# EAGLE design untitled (EAGLE 9.6.0)
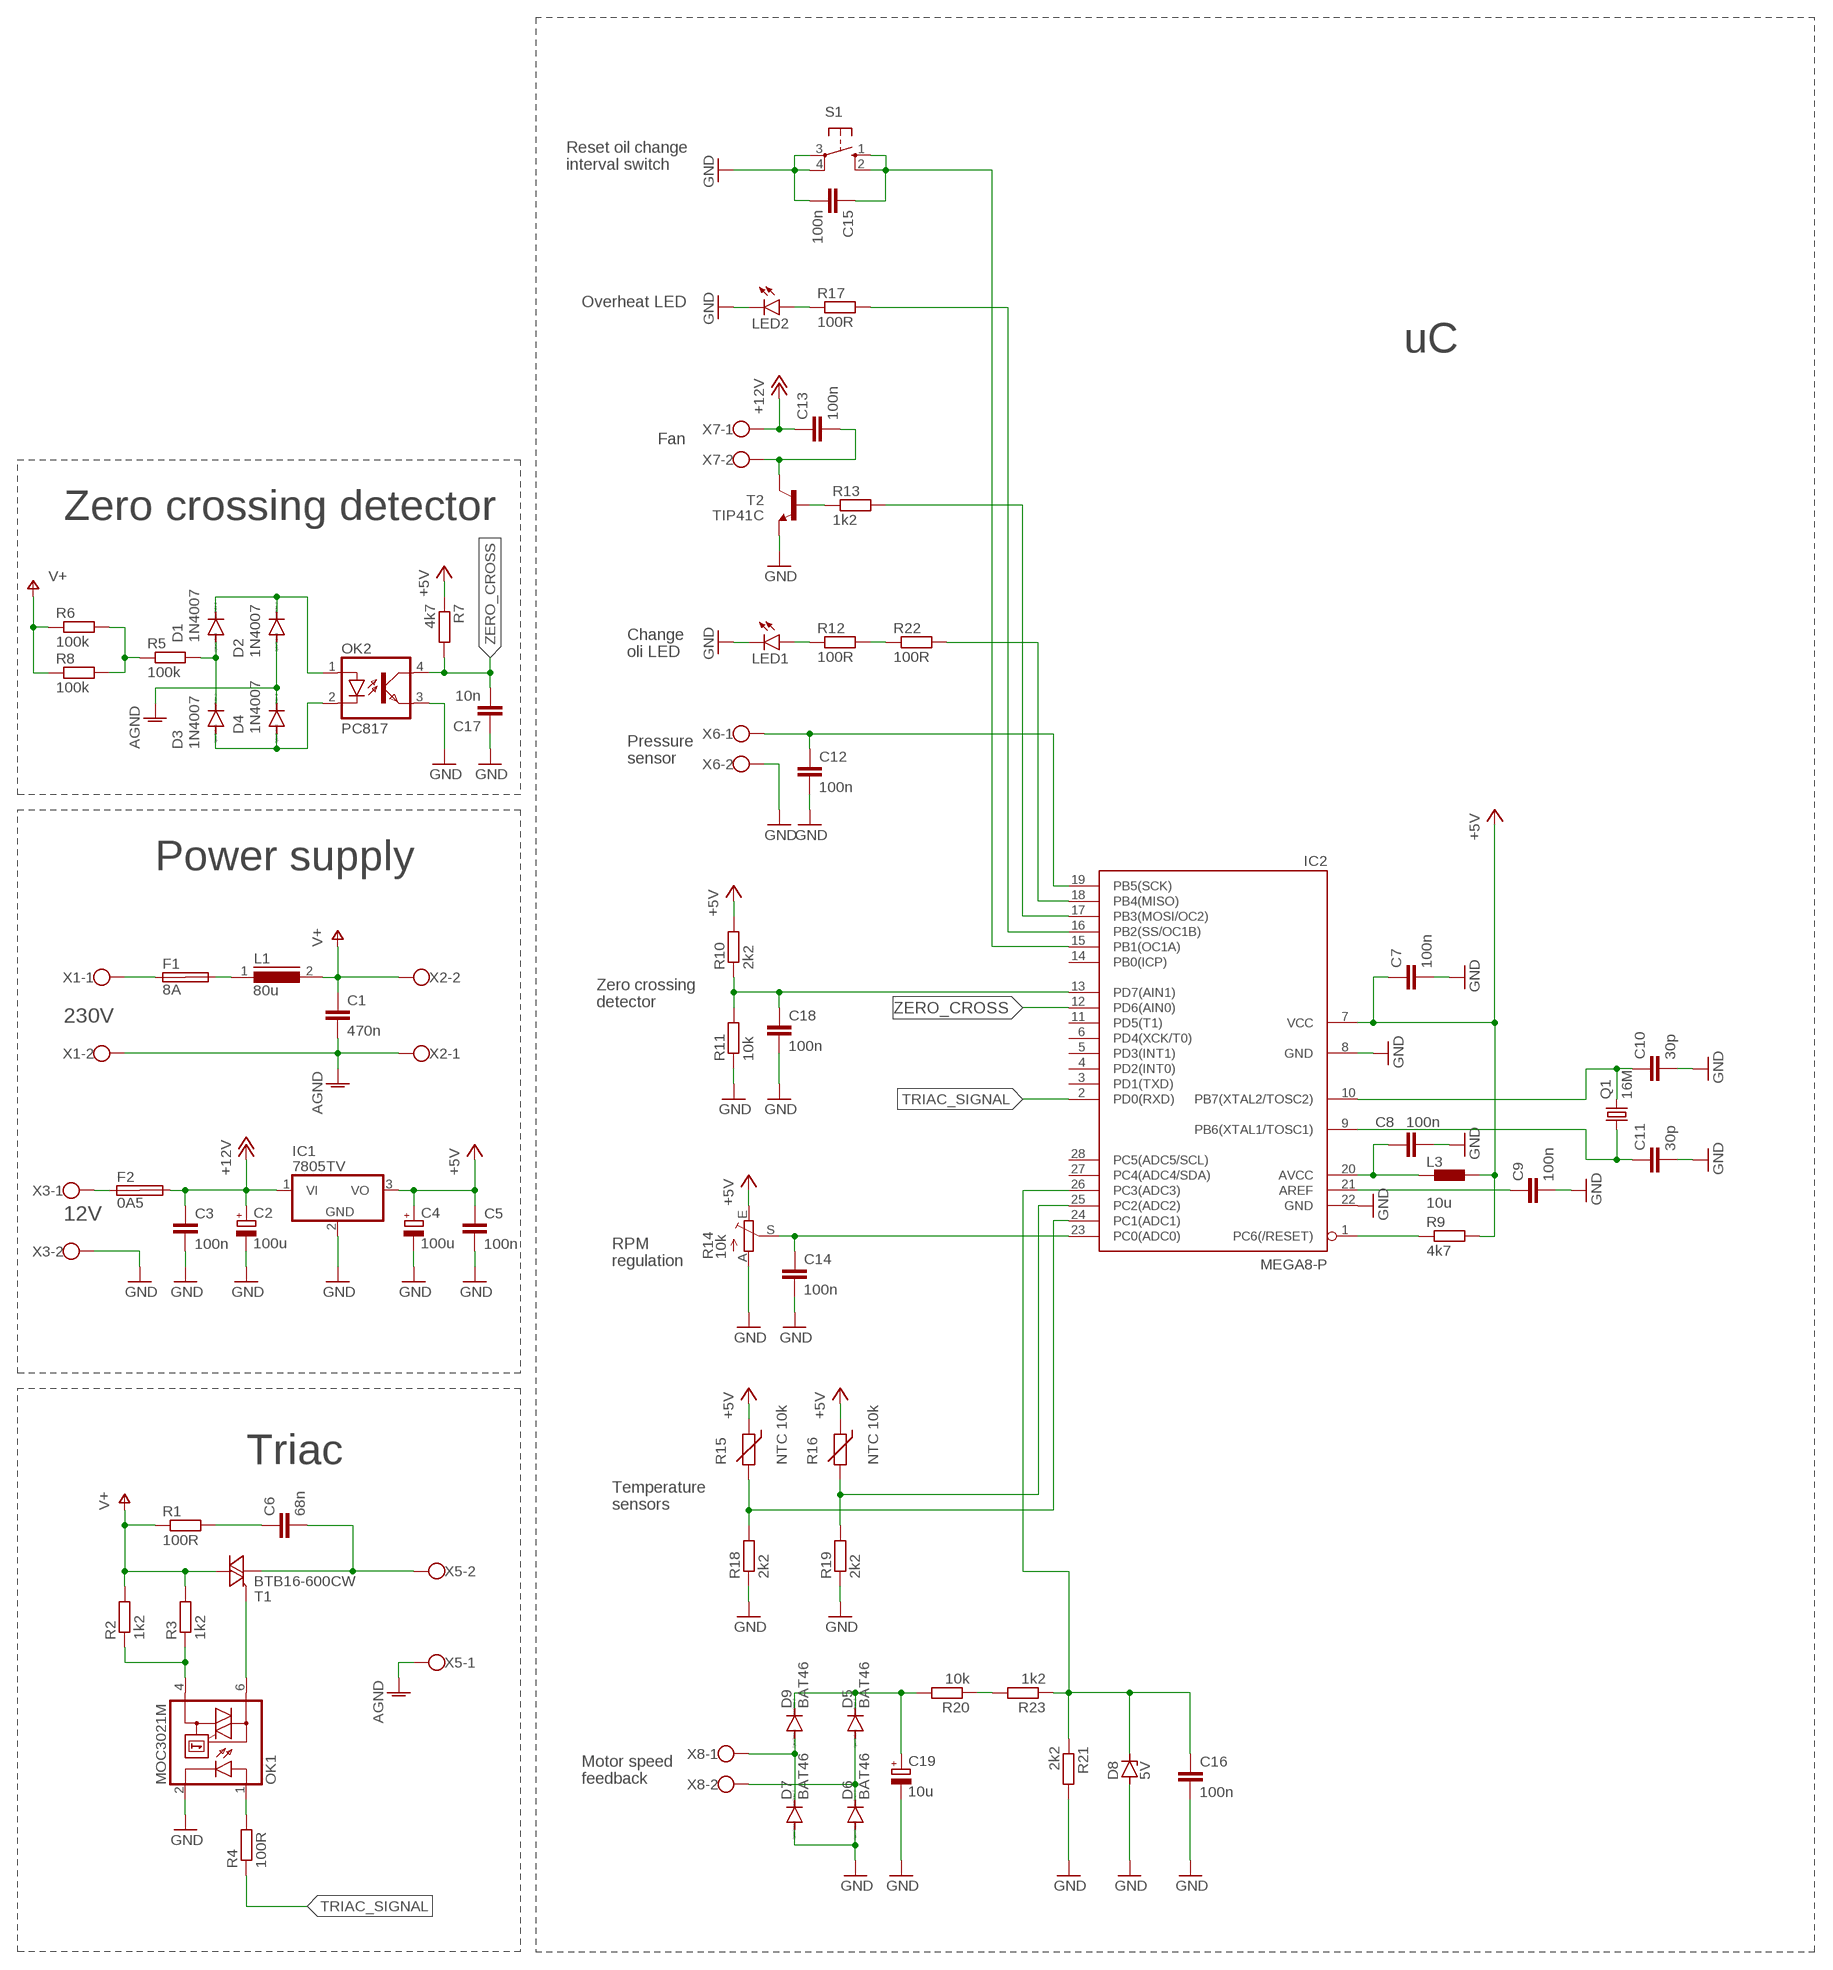
[diagram p0: schematic, sheet 1]

## Parts
C1  470n  C22/7  [C22.5B7]
C2  100u  CPOL-EUE3.5-8  [E3,5-8]
C3  100n  C5/3  [C5B3]
C4  100u  CPOL-EUE3.5-8  [E3,5-8]
C5  100n  C5/3  [C5B3]
C6  68n  C-EU150-084X183  [C150-084X183]
C7  100n  C5/3  [C5B3]
C8  100n  C5/3  [C5B3]
C9  100n  C5/3  [C5B3]
C10  30p  C5/3  [C5B3]
C11  30p  C5/3  [C5B3]
C12  100n  C5/3  [C5B3]
C13  100n  C5/3  [C5B3]
C14  100n  C5/3  [C5B3]
C15  100n  C5/3  [C5B3]
C16  100n  C5/3  [C5B3]
C17  10n  C5/3  [C5B3]
C18  100n  C5/3  [C5B3]
C19  10u  CPOL-EUE2.5-6  [E2,5-6]
D1  1N4007  1N4933  [DO41-10]
D2  1N4007  1N4933  [DO41-10]
D3  1N4007  1N4933  [DO41-10]
D4  1N4007  1N4933  [DO41-10]
D5  BAT46  BAS15  [DO34-7]
D6  BAT46  BAS15  [DO34-7]
D7  BAT46  BAS15  [DO34-7]
D8  5V  ZENER-DIODEDO34-7  [DO34Z7]
D9  BAT46  BAS15  [DO34-7]
F1  8A  SHK20L  [SHK20L]
F2  0A5  SHK20L  [SHK20L]
IC1  7805TV  [TO220V]
IC2  MEGA8-P  [DIL28-3]
L1  80u  SFT1030  [SFT1030]
L3  10u  BL01RN1A  [BL01RN1A]
LED1  LED5MM  [LED5MM]
LED2  LED5MM  [LED5MM]
OK1  MOC3021M  [DIL06]
OK2  PC817  [DIL04]
Q1  16M  CRYSTALHC49S  [HC49/S]
R1  100R  R-EU_0204/7  [0204/7]
R2  1k2  R-EU_0204/7  [0204/7]
R3  1k2  R-EU_0204/7  [0204/7]
R4  100R  R-EU_0204/7  [0204/7]
R5  100k  R-EU_0204/7  [0204/7]
R6  100k  R-EU_0204/7  [0204/7]
R7  4k7  R-EU_0204/7  [0204/7]
R8  100k  R-EU_0204/7  [0204/7]
R9  4k7  R-EU_0204/7  [0204/7]
R10  2k2  R-EU_0204/7  [0204/7]
R11  10k  R-EU_0204/7  [0204/7]
R12  100R  R-EU_0204/7  [0204/7]
R13  1k2  R-EU_0204/7  [0204/7]
R14  10k  TRIM_EU-RJ9W  [RJ9W]
R15  NTC 10k  THERMISTOR-7,5  [R-7,5]
R16  NTC 10k  THERMISTOR-7,5  [R-7,5]
R17  100R  R-EU_0204/7  [0204/7]
R18  2k2  R-EU_0204/7  [0204/7]
R19  2k2  R-EU_0204/7  [0204/7]
R20  10k  R-EU_0204/7  [0204/7]
R21  2k2  R-EU_0204/7  [0204/7]
R22  100R  R-EU_0204/7  [0204/7]
R23  1k2  R-EU_0204/7  [0204/7]
S1  10-XX  [B3F-10XX]
T1  BTB16-600CW  BT138-V  [TO220BV]
T2  TIP41C  -NPN-TO220V  [TO220V]
X1  W237-102  [W237-102]
X2  W237-102  [W237-102]
X3  W237-102  [W237-102]
X5  W237-102  [W237-102]
X6  W237-102  [W237-102]
X7  W237-102  [W237-102]
X8  W237-102  [W237-102]

## Nets
+5V: C4.+ C5.1 C7.1 IC1.3(VO) IC2.7(VCC) L3.2 R7.1 R9.2 R10.2 R14.E R15.1 R16.1
+12V: C2.+ C3.1 C13.1 F2.2A IC1.1(VI) X7.1
AGND: C1.2 D2.A D4.C X1.2 X2.1 X5.1
GND: C2.- C3.2 C4.- C5.2 C7.2 C8.2 C9.2 C10.2 C11.2 C12.2 C14.2 C15.2 C16.2 C17.1 C18.2 C19.- D6.A D7.A D8.A IC1.2(GND) IC2.8(GND) IC2.22(GND) LED1.K(C) LED2.K(C) OK1.2(C) OK2.3(EMIT) R11.1 R14.A R18.1 R19.1 R21.2 S1.3(P) S1.4(P1) T2.3(E) X3.2 X6.2
N$1: F1.1A X1.1
N$2: F1.2A L1.1
N$3: OK1.6(A2) T1.G
N$4: C6.2 T1.T1(A1) X5.2
N$5: C6.1 R1.2
N$6: OK1.4(A1) R2.1 R3.1
N$7: F2.1A X3.1
N$8: OK1.1(A) R4.2
N$9: D1.C D2.C OK2.1(A)
N$10: D3.A D4.A OK2.2(C)
N$11: R5.1 R6.2 R8.2
N$12: D7.C D9.A X8.1
N$13: C18.1 IC2.13(PD7(AIN1)) R10.1 R11.2
N$14: C8.1 IC2.20(AVCC) L3.1
N$15: C9.1 IC2.21(AREF)
N$16: IC2.1(PC6(/RESET)) R9.1
N$17: C10.1 IC2.10(PB7(XTAL2/TOSC2)) Q1.2
N$18: C11.1 IC2.9(PB6(XTAL1/TOSC1)) Q1.1
N$19: C12.1 IC2.19(PB5(SCK)) X6.1
N$20: LED1.A R12.1
N$21: IC2.18(PB4(MISO)) R22.2
N$22: C13.2 T2.2(C) X7.2
N$23: R13.1 T2.1(B)
N$24: IC2.17(PB3(MOSI/OC2)) R13.2
N$25: C14.1 IC2.23(PC0(ADC0)) R14.S
N$26: IC2.24(PC1(ADC1)) R15.2 R18.2
N$27: IC2.25(PC2(ADC2)) R16.2 R19.2
N$28: LED2.A R17.1
N$29: IC2.16(PB2(SS/OC1B)) R17.2
N$30: C19.+ D5.C D9.C R20.2
N$31: C15.1 IC2.15(PB1(OC1A)) S1.1(S) S1.2(S1)
N$32: D1.A D3.C R5.2
N$33: D5.A D6.C X8.2
N$34: C16.1 D8.C IC2.26(PC3(ADC3)) R21.1 R23.1
N$35: R12.2 R22.1
N$36: R20.1 R23.2
TRIAC_SIGNAL: IC2.2(PD0(RXD)) R4.1
V+: C1.1 L1.2 R1.1 R2.2 R3.2 R6.1 R8.1 T1.T2(A2) X2.2
ZERO_CROSS: C17.2 IC2.12(PD6(AIN0)) OK2.4(COL) R7.2
Unconnected: F1.1B F1.2B F2.1B F2.2B IC2.3(PD1(TXD)) IC2.4(PD2(INT0)) IC2.5(PD3(INT1)) IC2.6(PD4(XCK/T0)) IC2.11(PD5(T1)) IC2.14(PB0(ICP)) IC2.27(PC4(ADC4/SDA)) IC2.28(PC5(ADC5/SCL))

## Notes on the sheet
- Reset oil change
  interval switch
- Overheat LED
- uC
- Fan
- Zero crossing detector
- Change
  oli LED
- Pressure
  sensor
- Power supply
- Zero crossing
  detector
- 230V
- 12V
- RPM
  regulation
- Triac
- Temperature
  sensors
- Motor speed
  feedback

## Library data of the parts
C1 C3 C5 C7-C18 = capacitor-wima:C: CAPACITOR naming: grid - package width
C2 C4 C19 = rcl:CPOL-EU: POLARIZED CAPACITOR, European symbol; SPICEPREFIX: C
C6 = rcl:C-EU: CAPACITOR, European symbol; SPICEPREFIX: C
D1-D4 = diode:1N4933: DIODE fast recovery rectifier, 1A
D5-D7 D9 = diode:BAS15: DIODE high speed
D8 = diode:ZENER-DIODE: Z-Diode
F1 F2 = fuse:SHK20L: FUSE HOLDER 5 x 20 mm, SH contact, SHH1 Schukat, E1073 Buerklin; OC_FARNELL: unknown; OC_NEWARK: unknown
IC1 = linear:78*: Positive VOLTAGE REGULATOR Source: http://cache.national.com/ds/LM/LM78L05.pdf http://www.fairchildsemi.com/ds/LM/LM7805.pdf
IC2 = atmel:MEGA8-P: MICROCONTROLLER 8 Kbytes FLASH, 1 kbytes SRAM, 512 bytes EEPROM, USART, 4-channel 10 bit ADC, 2-channel 8 bit ADC Pin compatible with Atmega48, ATMega88, ATMega168 Source: avr.lbr; OC_FARNELL: unknown; OC_NEWARK: unknown
L1 = inductors:SFT1030: INDUCTOR; SPICEPREFIX: L
L3 = inductors:BL0: Noise Suppression Products/EMI Suppression Filters, Lead EMIFIL(R) Inductor Type Source: http://www.murata.com .. BL01RN1_DS.pdf
LED1 LED2 = led:LED: LED OSRAM: - CHIPLED LG R971, LG N971, LY N971, LG Q971, LY Q971, LO R971, LY R971 LH N974, LH R974 LS Q976, LO Q976, LY Q976 LO Q996 - Hyper CHIPLED LW Q18S LB Q993, LB Q99A, LB R99A - SideLED LS A670, LO A670, LY A670, LG A670, LP A670 LB A673, LV A673, LT A673, LW A673 LH A674 LY A675 LS A676, LA A676, LO A676, LY A676, LW A676 LS A679, LY A679, LG A679 - Hyper Micro SIDELED® LS Y876, LA Y876, LO Y876, LY Y876 LT Y87S - SmartLED LW L88C, LW L88S LB L89C, LB L89S, LG L890 LS L89K, LO L89K, LY L89K LS L896, LA L896, LO L896, LY L896 - TOPLED LS T670, LO T670, LY T670, LG T670, LP T670 LSG T670, LSP T670, LSY T670, LOP T670, LYG T670 LG T671, LOG T671, LSG T671 LB T673, LV T673, LT T673, LW T673 LH T674 LS T676, LA T676, LO T676, LY T676, LB T676, LH T676, LSB T676, LW T676 LB T67C, LV T67C, LT T67C, LS T67K, LO T67K, LY T67K, LW E67C LS E67B, LA E67B, LO E67B, LY E67B, LB E67C, LV E67C, LT E67C LW T67C LS T679, LY T679, LG T679 LS T770, LO T770, LY T770, LG T770, LP T770 LB T773, LV T773, LT T773, LW T773 LH T774 LS E675, LA E675, LY E675, LS T675 LS T776, LA T776, LO T776, LY T776, LB T776 LHGB T686 LT T68C, LB T68C - Hyper Mini TOPLED® LB M676 - Mini TOPLED Santana® LG M470 LS M47K, LO M47K, LY M47K Source: http://www.osram.convergy.de LUXEON: - LUMILED® LXK2-PW12-R00, LXK2-PW12-S00, LXK2-PW14-U00, LXK2-PW14-V00 LXK2-PM12-R00, LXK2-PM12-S00, LXK2-PM14-U00 LXK2-PE12-Q00, LXK2-PE12-R00, LXK2-PE12-S00, LXK2-PE14-T00, LXK2-PE14-U00 LXK2-PB12-K00, LXK2-PB12-L00, LXK2-PB12-M00, LXK2-PB14-N00, LXK2-PB14-P00, LXK2-PB14-Q00 LXK2-PR12-L00, LXK2-PR12-M00, LXK2-PR14-Q00, LXK2-PR14-R00 LXK2-PD12-Q00, LXK2-PD12-R00, LXK2-PD12-S00 LXK2-PH12-R00, LXK2-PH12-S00 LXK2-PL12-P00, LXK2-PL12-Q00, LXK2-PL12-R00 Source: www.luxeon.com KINGBRIGHT: KA-3528ASYC Source: www.kingbright.com
OK1 = optocoupler:MOC30*M: RANDOM-PHASE OPTOISOLATORS TRIAC DRIVER OUTPUT Source: http://www.fairchildsemi.com MOC3020-M.pdf; MF: FAIRCHILD SEMICONDUCTOR; MPN: MOC3021-M; OC_FARNELL: 1021365; OC_NEWARK: 95B7895
OK2 = optocoupler:PC817: SHARP OPTO COUPLER; MPN: PC817X4J000F; OC_FARNELL: 9707727; OC_NEWARK: 97K7059
Q1 = crystal:CRYSTAL: CRYSTAL; OC_FARNELL: 1667008; OC_NEWARK: unknown
R1-R13 R17-R23 = rcl:R-EU_: RESISTOR, European symbol; SPICEPREFIX: R
R14 = pot:TRIM_EU-: POTENTIOMETER
R15 R16 = varistor:THERMISTOR: THERMISTOR
S1 = switch-omron:10-XX: OMRON SWITCH; MPN: B3F-1000; OC_FARNELL: 176432; OC_NEWARK: 36M3542
T1 = triac:BT138: TRIAC Source: http://www.semiconductors.philips.com BT138_SERIES_2.pdf
T2 = transistor:*-NPN-: NPN Transistror BF959 corrected 2008.03.06
X1-X3 X5-X8 = con-wago-500:W237-102: WAGO SCREW CLAMP; MPN: 237-102; OC_FARNELL: unknown; OC_NEWARK: 70K9898

## Board
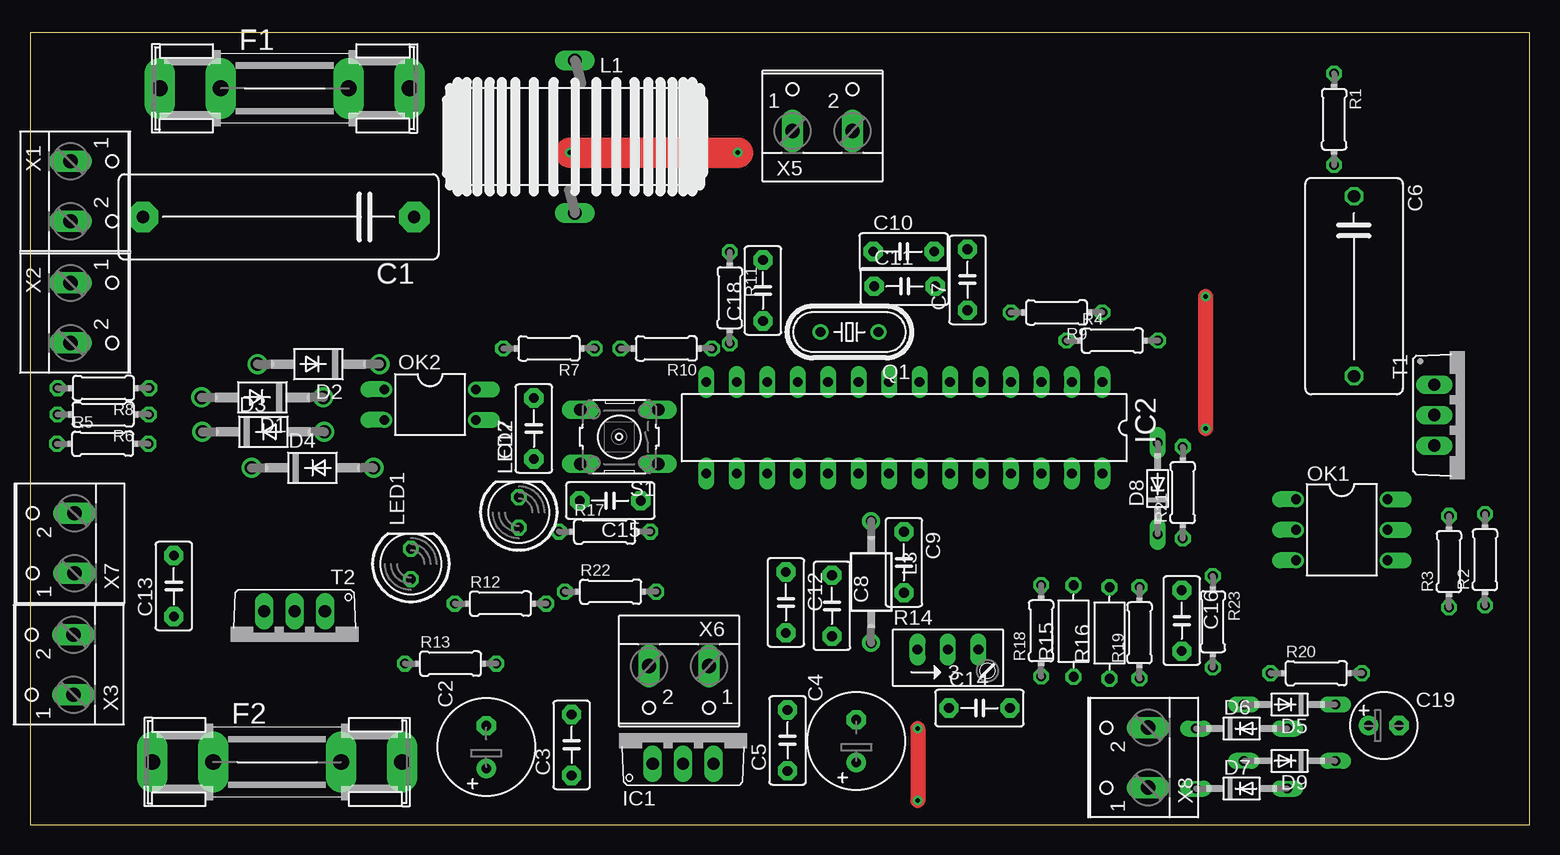
[diagram p1: board, top side]
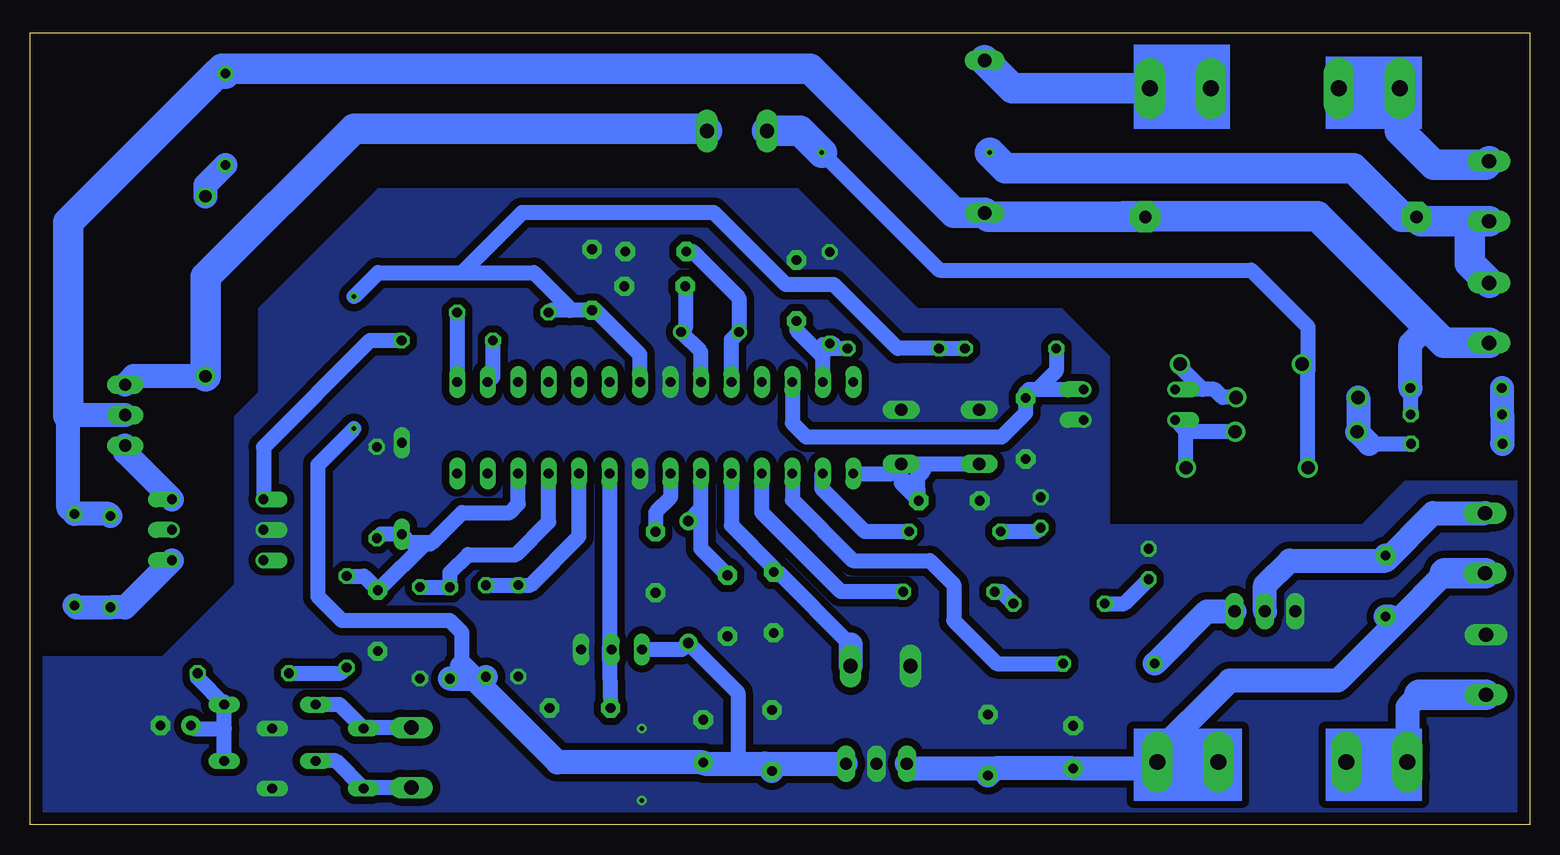
[diagram p2: board, bottom side, seen from below]

Size 125 x 66 mm. Coordinates in mm from the lower left corner, seen from the top.
Outline: 0,0 125,0 125,66 0,66 0,0
Copper layers (1*16): Top 0.035mm / dielectric 1.5mm / Bottom 0.035mm
Design rules "default": minimum track width 6mil, minimum drill 0.35mm, track to track 6mil, track to pad 6mil, pad to pad 6mil, via to via 6mil, smd to smd 6mil, copper to edge 40mil, drill to drill 6mil, minimum pad ring 10mil, minimum via ring 8mil, stop-mask expansion 4mil, vias tented up to drill 0mil, thermal gap 10mil

### Footprints (pad centres in the part's own frame; a part is rotated, then mirrored left to right if it is on the bottom)
C22.5B7 = drill 1.016 pad 2.54 octagon: 1 -11.303,0; 2 11.303,0
E3,5-8 = drill 0.813 pad 1.6: + -1.778,0 | drill 0.813 pad 1.6 octagon: - 1.778,0
C5B3 = drill 0.813 pad 1.6 octagon: 1 -2.54,0; 2 2.54,0
C150-084X183 = drill 1.016 octagon: 1 -7.493,0; 2 7.493,0
E2,5-6 = drill 0.813 pad 1.6: + -1.27,0 | drill 0.813 pad 1.6 octagon: - 1.27,0
DO41-10 = drill 1.118: A 5.08,0; C -5.08,0
DO34-7 = drill 0.813 long: A 3.81,0; C -3.81,0
DO34Z7 = drill 0.813 long: A 3.81,0; C -3.81,0
SHK20L = drill 1.321 pad 2.54 long: 1A -10.414,0; 1B -5.334,0; 2A 10.414,0; 2B 5.334,0
TO220V = drill 1.016 long: 1 -2.54,-2.54; 2 0,-2.54; 3 2.54,-2.54
DIL28-3 = drill 0.813 long: 1 -16.51,-3.81; 2 -13.97,-3.81; 3 -11.43,-3.81; 4 -8.89,-3.81; 5 -6.35,-3.81; 6 -3.81,-3.81; 7 -1.27,-3.81; 8 1.27,-3.81; 9 3.81,-3.81; 10 6.35,-3.81; 11 8.89,-3.81; 12 11.43,-3.81; 13 13.97,-3.81; 14 16.51,-3.81; 15 16.51,3.81; 16 13.97,3.81; 17 11.43,3.81; 18 8.89,3.81; 19 6.35,3.81; 20 3.81,3.81; 21 1.27,3.81; 22 -1.27,3.81; 23 -3.81,3.81; 24 -6.35,3.81; 25 -8.89,3.81; 26 -11.43,3.81; 27 -13.97,3.81; 28 -16.51,3.81
SFT1030 = drill 1.118 long: 1 -6.35,0; 2 6.35,0
BL01RN1A = drill 0.9 pad 1.5: 1 -5.08,0; 2 5.08,0
LED5MM = drill 0.813 octagon: A -1.27,0; K 1.27,0
DIL06 = drill 0.813 offset: 1 -2.54,-3.81; 2 0,-3.81; 3 2.54,-3.81; 4 2.54,3.81; 5 0,3.81; 6 -2.54,3.81
DIL04 = drill 0.813 offset: 1 -1.27,-3.81; 2 1.27,-3.81; 3 1.27,3.81; 4 -1.27,3.81
HC49/S = drill 0.813: 1 -2.413,0; 2 2.413,0
0204/7 = drill 0.813 octagon: 1 -3.81,0; 2 3.81,0
RJ9W = drill 0.813 long: A 2.54,0.635; E -2.54,0.635; S 0,0.635
R-7,5 = drill 0.813 octagon: 1 -3.81,0; 2 3.81,0
B3F-10XX = drill 1.016 long: 1 -3.251,2.261; 2 3.251,2.261; 3 -3.251,-2.261; 4 3.251,-2.261
TO220BV = drill 1.016 long: G 2.54,-2.54; T1 -2.54,-2.54; T2 0,-2.54
W237-102 = drill 1.194 long: 1 -2.5,-1.27; 2 2.5,-1.27

### Placement (x,y rotation side)
C1  20.72,50.63 180 top
C2  38.04,6.45 90 top
C3  45.15,6.63 90 top
C4  68.88,6.95 90 top
C5  63.15,7.01 90 top
C6  110.37,44.86 270 top
C7  78.15,45.39 90 top
C8  66.85,18.23 270 top
C9  72.85,21.85 270 top
C10  72.83,47.75 0 top
C11  72.91,44.85 0 top
C12  63.01,18.51 270 top
C13  11.99,19.87 90 top
C14  79.15,9.71 0 top
C15  48.37,26.99 180 top
C16  96.01,16.99 270 top
C17  42,33 90 top
C18  61.1,44.5 90 top
C19  112.85,8.25 0 top
D1  19.37,35.59 180 top
D2  24.05,38.37 180 top
D3  19.45,32.73 0 top
D4  23.55,29.73 0 top
D5  105,10 180 top
D6  101,8 0 top
D7  101,3 0 top
D8  94,28 90 top
D9  105,5.3 180 top
F1  21.23,61.35 0 top
F2  20.6,5.21 0 top
IC1  54.45,7.61 0 top
IC2  72.88,33.06 180 top
L1  45.43,57.32 270 top
L3  70.12,20.21 270 top
LED1  31.75,21.71 90 top
LED2  40.75,26.01 90 top
OK1  109.35,24.56 270 top
OK2  33.35,34.99 270 top
Q1  68.31,41.04 180 top
R1  108.71,58.77 270 top
R2  121.29,22.07 90 top
R3  118.29,21.91 90 top
R4  90.22,40.33 0 top
R5  6.06,31.73 0 top
R6  6.1,34.17 180 top
R7  43.26,39.67 180 top
R8  6.12,36.37 180 top
R9  85.58,42.67 180 top
R10  53.04,39.67 180 top
R11  58.33,43.9 270 top
R12  39.22,18.41 0 top
R13  35.06,13.41 0 top
R14  76.52,13.96 0 top
R15  86.99,16.12 90 top
R16  89.99,15.96 90 top
R17  47.9,24.41 0 top
R18  84.29,16.14 90 top
R19  92.49,15.98 90 top
R20  107.22,12.61 0 top
R21  96.09,27.66 90 top
R22  48.4,19.4 0 top
R23  98.6,16.9 270 top
S1  49.12,32.31 180 top
T1  119.61,34.12 270 top
T2  22.05,15.23 180 top
X1  4.64,52.77 270 top
X2  4.64,42.63 270 top
X3  2.36,13.31 90 top
X5  66.06,59.07 0 top
X6  54.1,11.93 180 top
X7  2.43,23.44 90 top
X8  91.93,5.58 90 top

### Tracks (layer width: path | path; a pad name or v marks a point on that pad's centre or on a via)
+5V  (via drill 0.35)
  Top 1.27: v98,33 v98,44
  Bottom 1.27: IC2.7 74.15,39.15 78,43 C7.1 80,42.85 | 80,42.85 81.59,42.85 R9.2 | 66,5.07 66,11 L3.2 70.66,14.6 R14.E | 88,12.15 87.15,12.15 | R7.1 R10.2 52.67,39.67 58,45 62,45 68,51 84,51 89,46 | 89,13.15 89,16 90,17 99,17 101,19 101,30 v98,33 | v98,44 96,46 89,46 | 89,46 83,46 80,43 80,42.85
  Bottom 2: 63.75,5.07 66,5.07 68.78,5.07 C4.+ 81.02,5.17 88,12.15 | 63.75,5.07 IC1.3 | C5.1 63.75,5.07 | R16.1 88,12.15 | 87.15,12.15 R15.1 | 88,12.15 89,13.15
+12V
  Bottom 2: F2.2A 31.55,4.67 C2.+ 44.57,4.67 | 44.57,4.67 C3.1 | IC1.1 51.51,4.67 44.57,4.67 | 7.06,20.94 11,17 | 11,17 16,12 25,12 31.55,5.45 | C13.1 11.65,17.33 11.32,17 11,17
  Bottom 2.54: X7.1 7.06,20.94 | 31.55,5.45 31.55,4.67
AGND  (via drill 0.35)
  Top 2.54: v59,56 v45,56
  Bottom 1.27: D4.C 18.47,37.87 | 18.47,37.87 D2.A | v59,56 49.2,46.2 23.2,46.2 18.47,41.47 18.47,37.87
  Bottom 2.54: 5,50.27 9.06,50.27 C1.2 10.63,50.63 14.7,54.7 43.7,54.7 v45,56 | 5,50.27 X1.2 | X2.1 5,46.76 5,50.27 | X5.1 60.8,57.8 v59,56
GND  (via drill 0.35)
  Top 1.27: v74,8 v74,2
  pour Bottom (isolate 0.61, no thermals): 0,28.6 10.4,28.6 14,25 35,25 35,39 39,43 51,43 61,53 96,53 106,43 106,36 108,34 108,20 114,14 125,14 125,0 0,0
N$1
  Bottom 2.54: F1.1A 10.82,57.82 8,55 3.64,55 X1.1
N$2
  Bottom 2.54: F1.2A 43.11,61.35 L1.1
N$3
  Bottom 2: OK1.6 117.07,31.01 T1.G
N$4
  Bottom 2: C6.2 116.36,37.37 T1.T1
  Bottom 2.54: C6.2 110.37,45.63 98,58 68.76,58 X5.2
N$5
  Bottom 2: C6.1 110.37,53.3 R1.2
N$6
  Bottom 2: R2.1 121.13,18.1 R3.1 117.08,18.1 OK1.4
N$7
  Bottom 2: F2.1A 10.19,9.81 9.19,10.81
  Bottom 2.54: X3.1 9.19,10.81
N$8
  Bottom 1.27: OK1.1 105.54,31.46 96.67,40.33 R4.2
N$9
  Bottom 1.27: D1.C 25.59,35.59 26.26,36.26 27.26,36.26 | 27.26,36.26 OK2.1 | D2.C 29.13,38.13 27.26,36.26
N$10
  Bottom 1.27: D3.A 28.55,32.73 OK2.2 28.63,32.81 D4.A
N$11
  Bottom 2: R8.2 2.31,34.19 R6.2 2.29,31.77 R5.1
N$12
  Bottom 1.27: X8.1 97.11,3.08 D7.C 99.49,5.3 D9.A
N$13
  Bottom 1.27: 58.91,39 IC2.13 58.91,39.31 58.55,39.67 R10.1 57.91,39.67 R11.2 58.09,40.09 58,40 58.91,40 58.91,39 | C18.1 61.1,41.19 58.91,39
N$14
  Bottom 1.27: L3.1 69.07,26.34 | 69.07,26.34 IC2.20 | C8.1 69.07,22.99 69.07,26.34
N$15
  Bottom 1.27: IC2.21 71.61,27.25 72.85,26.01 C9.1
N$16
  Bottom 1.27: R9.1 IC2.1
N$17
  Bottom 1.27: IC2.10 66.53,40.41 Q1.2 65.9,43.9 69.75,47.75 C10.1
N$18
  Bottom 1.27: IC2.9 69.07,39.39 Q1.1 70.37,41.39 C11.1
N$19
  Bottom 1.27: IC2.19 66.53,24.93 63.01,21.41 C12.1 62.65,21.05 56.6,15
  Bottom 2: 56.6,15 X6.1
N$20
  Bottom 1.27: LED1.A 33.78,18.41 R12.1
N$21
  Bottom 1.27: IC2.18 63.99,25.99 57.4,19.4 R22.2
N$22
  Bottom 2: T2.2 22.05,19.95 20,22 12,22 | X7.2 8.06,25.94 12,22 | C13.2 12,22
N$23
  Bottom 2: R13.1 26.89,17.77 T2.1
N$24
  Bottom 1.27: IC2.17 61.45,27.05 56.4,22 50,22 48,20 48,17 44.41,13.41 R13.2
N$25
  Bottom 1.27: IC2.23 76.69,14.77 R14.S 76.71,14.4 C14.1
N$26
  Bottom 1.27: R15.2 84.31,19.93 R18.2 83.29,19.95 79.23,24.01 IC2.24
N$27
  Bottom 1.27: R19.2 92.47,19.77 R16.2 89.99,21.01 88.5,22.5 84.5,22.5 81.77,25.23 IC2.25
N$28
  Bottom 1.27: LED2.A 41.08,24.41 R17.1
N$29
  Bottom 1.27: R17.2 55.41,24.41 59,28 59,29.16 IC2.16
N$30
  Bottom 1.27: D9.C 108.81,8 | 108.81,8 D5.C | D5.C 108.81,10.19 | C19.+ 111.33,8 108.81,8 | R20.2 111.03,12.22 D5.C
N$31
  Bottom 1.27: IC2.15 53.17,29.25 S1.1 | S1.1 51,30.05 | 51,30.05 S1.2 | S1.1 52.37,28.45 C15.1 51,27.08 51,28 | 51,28 51,30.05 | 51,28 51.5,28.5 50.5,29.5
N$32
  Bottom 1.27: 13.37,31.73 R5.2
  Bottom 2: D1.A 14.29,32.81 D3.C 13.37,31.73
N$33
  Bottom 1.27: X8.2 97.11,8.08 D6.C 99.19,10 D5.A
N$34
  Bottom 1.27: IC2.26 84.31,26.69 85,26 89,26 91.5,23.5 | 91.61,23.39 91.5,23.5 | 91.5,23.5 92,23.5 | 92,23.5 93.31,23.5 D8.C 95.75,24.19 R21.1 | 92,23.5 95.97,19.53 | 95.97,19.53 C16.1 | R23.1 97.15,20.71 95.97,19.53
N$35
  Bottom 1.27: R12.2 44.02,19.4 R22.1
N$36
  Bottom 1.27: R20.1 99.08,12.61 R23.2
TRIAC_SIGNAL
  Bottom 1.27: IC2.2 86.41,37.31 R4.1
V+
  Bottom 1.27: R6.1 9.91,36.35 | 33.86,50.67 36.96,50.67 37,50.63
  Bottom 2: T1.T2 121.8,34.12 121.8,26.39 R2.2 118.45,25.88 R3.2 | R1.1 109,62.87 109,63 | 10.33,43.33 12.5,45.5 | 9.91,36.35 R8.1 9.93,40.07 8.5,41.5
  Bottom 2.54: 33.02,50.63 C1.1 37,50.63 45.09,50.63 L1.2 47.97,50.97 60,63 109,63 | X2.2 7.13,40.13 8.5,41.5 12.5,45.5 17.67,50.67 33.86,50.67 | 121.8,34.12 121.8,50.2 109.42,62.58 R1.1
ZERO_CROSS
  Bottom 1.27: IC2.12 61.45,33.45 60.3,32.3 44,32.3 42,34.3 42,36 41.74,36.26 | 41.74,36.26 41,36.26 | 41,36.26 OK2.4 | R7.2 39.45,37.81 41,36.26 | C17.2 41.74,35.8 41.74,36.26
(copper drawn outside any net)
  shapes: Bottom area x4